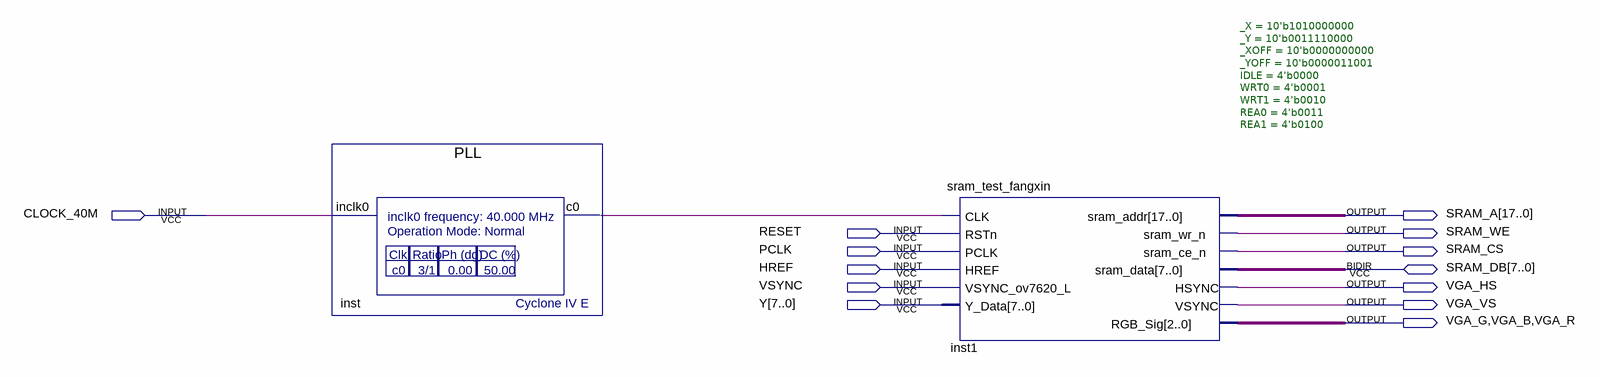
[diagram p0: schematic sheet]
// Quartus schematic _OV7620_sram_test_fangxin.bdf as structural Verilog: 2 symbols, 13 pins
module _OV7620_sram_test_fangxin (
  input  CLOCK_40M,
  input  RESET,
  input  PCLK,
  input  HREF,
  input  VSYNC,
  input  [7:0] Y,
  inout  [7:0] SRAM_DB,
  output [17:0] SRAM_A,
  output SRAM_WE,
  output SRAM_CS,
  output VGA_HS,
  output VGA_VS,
  output VGA_G,
  output VGA_B,
  output VGA_R
);

  wire inst_c0;

  PLL inst (.inclk0(CLOCK_40M), .c0(inst_c0));
  sram_test_fangxin #(._X(10'b1010000000), ._Y(10'b0011110000), ._XOFF(10'b0000000000), ._YOFF(10'b0000011001), .IDLE(4'b0000), .WRT0(4'b0001), .WRT1(4'b0010), .REA0(4'b0011), .REA1(4'b0100)) inst1 (
    .CLK(inst_c0), .RSTn(RESET), .PCLK(PCLK), .HREF(HREF), .VSYNC_ov7620_L(VSYNC), .Y_Data(Y),
    .sram_addr(SRAM_A), .sram_wr_n(SRAM_WE), .sram_ce_n(SRAM_CS), .HSYNC(VGA_HS), .VSYNC(VGA_VS),
    .RGB_Sig({VGA_G, VGA_B, VGA_R}), .sram_data(SRAM_DB));
endmodule
